# Altium schematic sheet converter.SchDoc
size A4; SheetNumber: 1; SheetTotal: 1
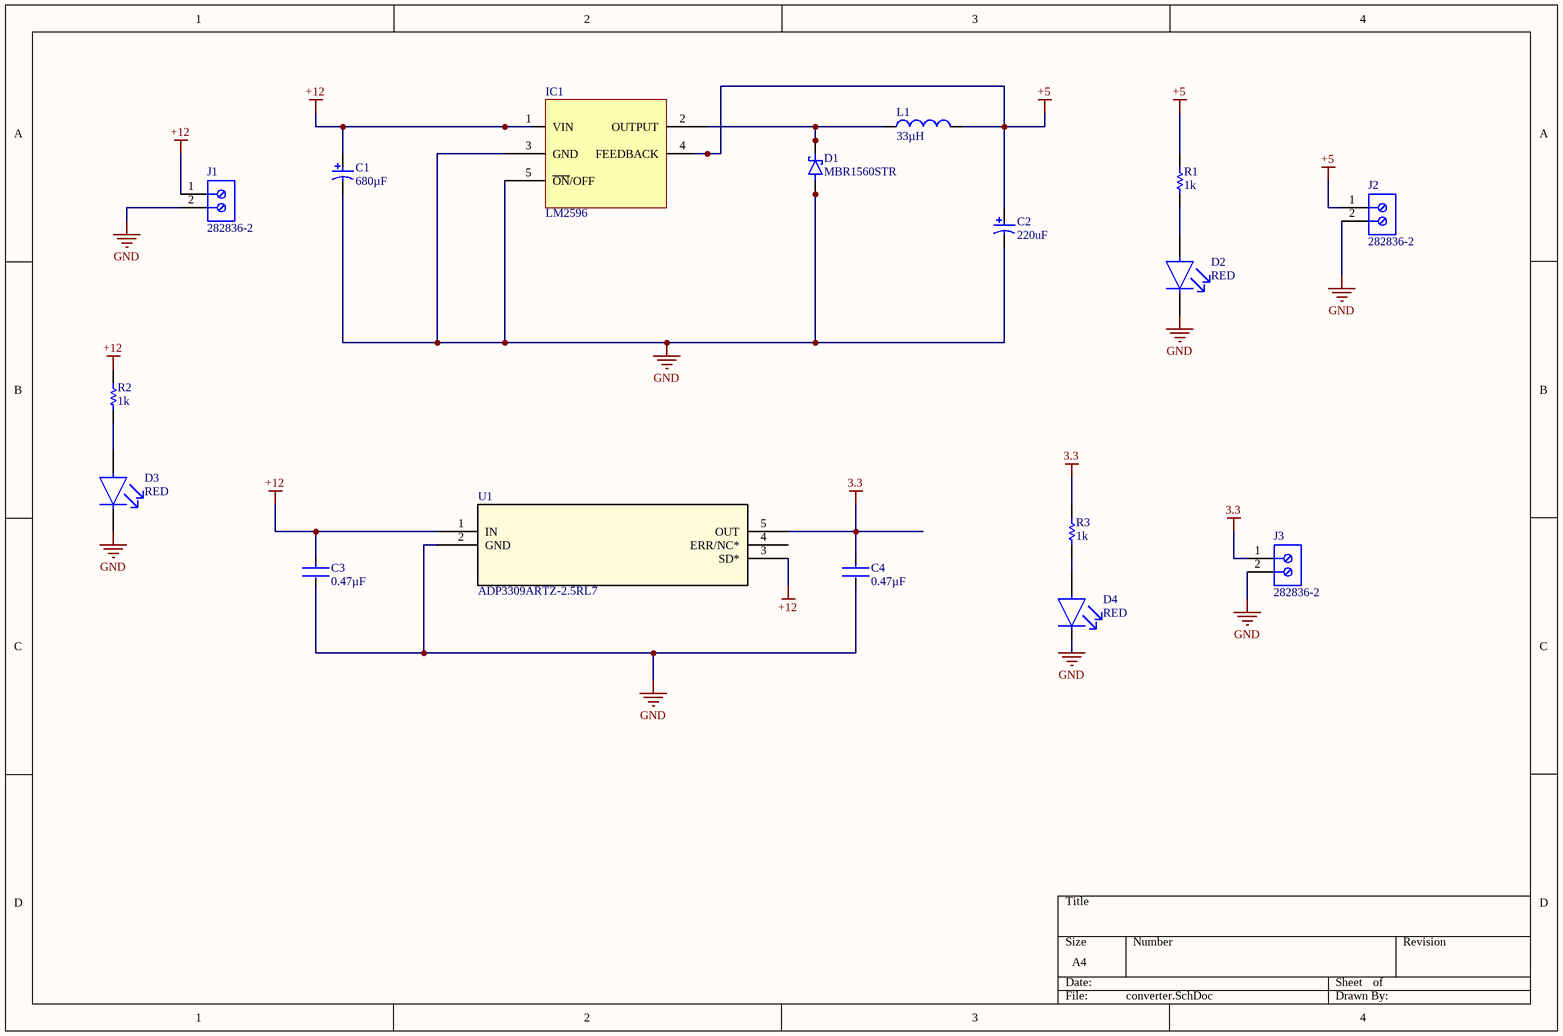
[diagram p0: converter.SchDoc]

## Parts
C1  Capacitance: 680µF  [PNSC-SVP-E12_L]  (hidden comment: 16SVP180M)
C2  Capacitance: 220uF  [PNSC-SVP-E12_L]  (hidden comment: 16SVP180M)
C3  Capacitance: 0.47µF  [FP-GRM188-0_1-e0_2_0_5-MFG]  (hidden comment: GRM188R71E474KA12D)
C4  Capacitance: 0.47µF  [FP-GRM188-0_1-e0_2_0_5-MFG]  (hidden comment: GRM188R71E474KA12D)
D1  MBR1560STR  [DIO_MBR1560STR]
D2  Color: RED  [FP-150060RS75000-MFG]  (hidden comment: 150060RS75000)
D3  Color: RED  [FP-150060RS75000-MFG]  (hidden comment: 150060RS75000)
D4  Color: RED  [FP-150060RS75000-MFG]  (hidden comment: 150060RS75000)
IC1  LM2596  [D2PAK]
J1  282836-2  [TECO-282836-2_V]
J2  282836-2  [TECO-282836-2_V]
J3  282836-2  [TECO-282836-2_V]
L1  Inductance: 33µH  [WE-PD-XXL]  (hidden comment: 7447709150)
R1  Resistance: 1k  [RESC1608X55X30LL15T15]  (hidden comment: ERJ-3EKF1001V)
R2  Resistance: 1k  [RESC1608X55X30LL15T15]  (hidden comment: ERJ-3EKF1001V)
R3  Resistance: 1k  [RESC1608X55X30LL15T15]  (hidden comment: ERJ-3EKF1001V)
U1  ADP3309ARTZ-2.5RL7  [RJ_5_ADI]

## Nets
3.3: C4.1 J3.1 R3.1 U1.5(OUT)
+5: C2.1 IC1.4(FEEDBACK) J2.1 L1.2 R1.1
+12: C1.1 C3.1 IC1.1(VIN) J1.1 R2.2 U1.1(IN) U1.3(SD*)
GND: C1.2 C2.2 C3.2 C4.2 D1.1(A) D1.2(A) D2.1(C) D3.1(C) D4.1(C) IC1.3(GND) IC1.5(~{ON}/OFF) J1.2 J2.2 J3.2 U1.2(GND)
NetD1_3: D1.3(K) D1.4(K) IC1.2(OUTPUT) L1.1
NetD2_2: D2.2(A) R1.2
NetD3_2: D3.2(A) R2.1
NetD4_2: D4.2(A) R3.2

Not connected (* = marked no-connect by the designer): U1 4(ERR/NC*)

## Library data of the parts
C1 C2 = CMP-2000-05492-1: Conductive Polymer Aluminum Solid Capacitor, 180 uF, +/- 20%, 16 V, -55 to 105 degC, 2-Pin SMD (E12), RoHS, Tape and Reel; Manufacturer: Panasonic; Voltage Rating: 16V; Product Range: PANASONIC-SVPSeries; Ripple Current AC: 3.64A; ESR: 0.02ohm; Capacitor Case Style: RadialCan-SMD; Life Time @ Temperature: 2000hours@105°C; SVHC: ToBeAdvised; Package Description: 2-Pin Surface Mount Device, Body 8.3 x 8.3 mm; Datasheet URL: https://industrial.panasonic.com/cdbs/www-data/pdf/AAB8000/AAB8000C193.pdf; Manufacturer URL: http://www.panasonic.com/; Datasheet Version: 11/2015; Packaging: CutTape; Diameter: 8mm; Package Reference: SVP-E12; Height: 11.9mm; Mounting Technology: SurfaceMount; Operating Temperature Min: -55°C; Capacitance Tolerance: ±20%; Operating Temperature Max: 105°C; Manufacturer Part Number: 16SVP180M
C3 C4 = CMP-06035-003857-1: Chip Multilayer Ceramic Capacitors for General Purpose, 0603, 0.47uF, X7R, 15%, 10%, 25V; Manufacturer: Murata; Voltage: 50V; Case Code (Imperial): 0603; Mount: Surface Mount; Material: Ceramic; Case/Package: 0603; Thickness: 0.035inch; Tolerance: 10%; Length: 1.6mm; Lead Free: Lead Free; Voltage Rating: 25V; Width: 0.031inch; Voltage Rating (DC): 25V; Dielectric: X7R; Case Code (Metric): 1608; Number of Pins: 2; Termination: SMD/SMT; REACH SVHC: No SVHC; Min Operating Temperature: -55°C; Max Operating Temperature: 125°C; Depth: 0.8mm; Height: 0.8mm; Package Quantity: 4000; Packaging: Tape and Reel; Manufacturer Part Number: GRM188R71E474KA12D
D1 = MBR1560STR: Diode Schottky 60V 15A Surface Mount TO-277B; MF: SMC Diode Solutions; SnapEDA_Link: https://www.snapeda.com/parts/MBR1560STR/SMC%20Diode%20Solutions/view-part/3611008/?ref=snap; MP: MBR1560STR; Availability: Warning; Price: None; Package: TO-277 SMC Diode Solutions; Value: *; Check_prices: https://www.snapeda.com/parts/MBR1560STR/SMC%20Diode%20Solutions/view-part/3611008/?ref=eda; Purchase-URL: https://pricing.snapeda.com/search/part/MBR1560STR/?ref=eda
D2-D4 = CMP-1426-00001-2: LED RED CLEAR 0603 SMD; Manufacturer: Wurth Electronics; Luminous Intensity: 250mcd; Viewing Angle: 140°; Dominant Wavelength: 625nm; Test Current: 20mA; Forward Current: 30mA; Forward Voltage: 2V; Lens Color: Colorless; Lens Size: 0.7mm; Width: 0.8mm; Series: WL-SMCW; Min Operating Temperature: -40°C; RoHS Compliant: Yes; Height: 0.8mm; Package Quantity: 1; Packaging: Cut Tape; Mount: Surface Mount; Case/Package: 0603; Lens Transparency: Clear; Length: 1.6mm; Case Code (Imperial): 0603; Lens Style: Clear; Wavelength: 625nm; Max Operating Temperature: 85°C; Case Code (Metric): 1608; Manufacturer Part Number: 150060RS75000
J1-J3 = CMP-1684-00017-1: Female Header, Pitch 5 mm, 1 x 2 Position, Height 10 mm, Tail Length 3.5 mm, Rohs, Bulk; Manufacturer: TE Connectivity; Wire Gauge: 16-30AWG; Product Training Modules: Wire-to-BoardEurostyleTerminalBlocks; Clamp Material - Plating: Brass-NickelPlated; Voltage: 300V; Mating Orientation: HorizontalwithBoard; Current: 13.5A; Pitch: 0.197"(5.00mm); Screw Thread: M3; 3D Model: 282836-2.pdf; Other Names: 5ULV-02B / A98076; Dynamic Catalog: BuchananSeries; Number of Levels: 1; Torque - Screw: 0.68Nm(6Lb-In); Featured Product: EurostyleTerminalBlockConnectors; Positions Per Level: 2; Wire Termination: Screw-RisingCageClamp; Datasheet URL: http://www.te.com.cn/commerce/DocumentDelivery/DDEController?Action=showdoc&DocId=Catalog+Section%7F1308389_EUROSTYLE_TERMINAL_BLOCKS%7F0607%7Fpdf%7FEnglish%7FENG_CS_1308389_EUROSTYLE_TERMINAL_BLOCKS_0607.pdf%7F282836-2; Color: Green; Family: TerminalBlocks-WiretoBoard; RoHS Information: 282836-2StatementofCompliance; Standard Package: 300; Contact Material - Plating: Brass-TinPlated; Manufacturer URL: http://www.te.com; Housing Material: Polyamide(PA66),Nylon6/6; Features: Interlocking(Side); Package Description: Female Header, Pitch 5 mm, 1 x 2 Position, Height 10 mm, Tail Length 3.5 mm; Mounting Type: ThroughHole; Package Reference: THD; Packaging: Bulk; Series: Buchanan; Category: Connectors,Interconnects; Screw Material - Plating: Brass-NickelPlated; Manufacturer Part Number: 282836-2
L1 = CMP-0227-00106-1: SMD-Shielded Power Inductor WE-PD, L = 15.0 µH; Manufacturer: Wurth Electronics; ComponentLink2Description: Datasheet; DatasheetVersion: ver 4, Oct-2006; PackageDescription: SMD Inductor, 2-Leads, Body 12.0 x 12.0 mm; ComponentLink1Description: Manufacturer Link; PackageVersion: 2004; ComponentLink2URL: http://www.we-online.de/katalog/media/pdf/7447709150.pdf; PackageReference: WE-PD-XXL; ComponentLink1URL: http://www.we-online.com; Manufacturer Part Number: 7447709150
R1-R3 = CMP-2000-00180-1: Manufacturer: Panasonic; Manufacturer Part Number: ERJ3EKF1001V; Power Rating: 100mW; Tolerance: 1%; Voltage Rating: 75V; Temperature Coefficient: 100ppm/°C; Part Number: ERJ-3EKF1001V; Supplier 1: Arrow Electronics; Supplier Part Number 1: ERJ-3EKF1001V; RoHS: Yes; Category: Chip SMD Resistors; Stock 1: 10000; Pricing 1: 5000=0,00840, 50000=0,00440, 60000=0,00430, 80000=0,00420, 200000=0,00410, 2000000=0,00400 (USD); Mount: Surface Mount; Case/Package: 0603; Number of Pins: 2; Case Code (Metric): 1608; Case Code (Imperial): 0603; Contact Plating: Tin; Size Code: 0603; Min Operating Temperature: -55°C; Max Operating Temperature: 155°C; Packaging: Tape and Reel; Resistor Type: Thick Film; Termination: SMD/SMT; Series: ERJ; Construction: Rectangular; Package Quantity: 5000; Number of Terminations: 2; Max Power Dissipation: 100mW; Resistance Tolerance: 1%; Features: Automotive AEC-Q200; Technology: THICK FILM; Voltage Rating (DC): 75V; Length: 1.6mm; Width: 0.8mm; Height: 0.45mm; Depth: 0.8mm; Radiation Hardening: No; Military Standard: Not; RoHS Compliant: Yes; REACH SVHC: No SVHC; Lead Free: Lead Free; ComponentLink1URL: https://datasheet.ciiva.com/7942/aoa0000ce2-7942427.pdf?src-supplier=Element14; ComponentLink1Description: https://datasheet.ciiva.com/7942/aoa0000ce2-7942427.pdf?src-supplier=Element14; ComponentLink2URL: https://datasheet.ciiva.com/46373/1678782-46373340.pdf?src-supplier=Element14; ComponentLink2Description: https://datasheet.ciiva.com/46373/1678782-46373340.pdf?src-supplier=Element14; ComponentLink3URL: https://datasheet.ciiva.com/22673/1678782-22673918.pdf?src-supplier=Element14; ComponentLink3Description: https://datasheet.ciiva.com/22673/1678782-22673918.pdf?src-supplier=Element14; ComponentLink4URL: https://datasheet.ciiva.com/46373/1678782-46373339.pdf?src-supplier=Element14; ComponentLink4Description: https://datasheet.ciiva.com/46373/1678782-46373339.pdf?src-supplier=Element14; ComponentLink5URL: https://datasheet.ciiva.com/24070/aoa0000ce2-24070269.pdf?src-supplier=Mouser; ComponentLink5Description: https://datasheet.ciiva.com/24070/aoa0000ce2-24070269.pdf?src-supplier=Mouser; ComponentLink6URL: https://datasheet.ciiva.com/16768/70260748-16768437.pdf?src-supplier=Allied+Electronics; ComponentLink6Description: https://datasheet.ciiva.com/16768/70260748-16768437.pdf?src-supplier=Allied+Electronics; ComponentLink7URL: https://datasheet.ciiva.com/16774/70260748-16774550.pdf?src-supplier=Allied+Electronics; ComponentLink7Description: https://datasheet.ciiva.com/16774/70260748-16774550.pdf?src-supplier=Allied+Electronics; ComponentLink8URL: https://datasheet.ciiva.com/9198/aoa0000ce2-9198923.pdf?src-supplier=Avnet; ComponentLink8Description: https://datasheet.ciiva.com/9198/aoa0000ce2-9198923.pdf?src-supplier=Avnet; ComponentLink9URL: https://datasheet.ciiva.com/16449/aoa0000ce2-16449065.pdf?src-supplier=Future+Electronics; ComponentLink9Description: https://datasheet.ciiva.com/16449/aoa0000ce2-16449065.pdf?src-supplier=Future+Electronics
U1 = ADP3309ARTZ-2.5RL7: No Description Available; Mfr_Name: Analog Devices Inc; Copyright: Copyright (C) 2022 Ultra Librarian. All rights reserved.; Manufacturer_Part_Number: ADP3309ARTZ-2.5RL7; Digi-Key_Part_Number_1: 2156-ADP3309ARTZ-2.5RL7-ND; Digi-Key_Part_Number_2: 505-ADP3309ARTZ-2.5RL7CT-ND; Digi-Key_Part_Number_3: 505-ADP3309ARTZ-2.5RL7DKR-ND; Digi-Key_Part_Number_4: 505-ADP3309ARTZ-2.5RL7TR-ND; Digi-Key_Part_Number_5: ADP3309ARTZ-2.5RL7-ND; Digi-Key_Part_Number_6: ADP3309ARTZ-2.5RL7CT-ND; Digi-Key_Part_Number_7: ADP3309ARTZ-2.5RL7DKR-ND; Digi-Key_Part_Number_8: ADP3309ARTZ-2.5RL7TR-ND; RefDes: RefDes; Type: DEV